# EAGLE design untitled (EAGLE 5.11)
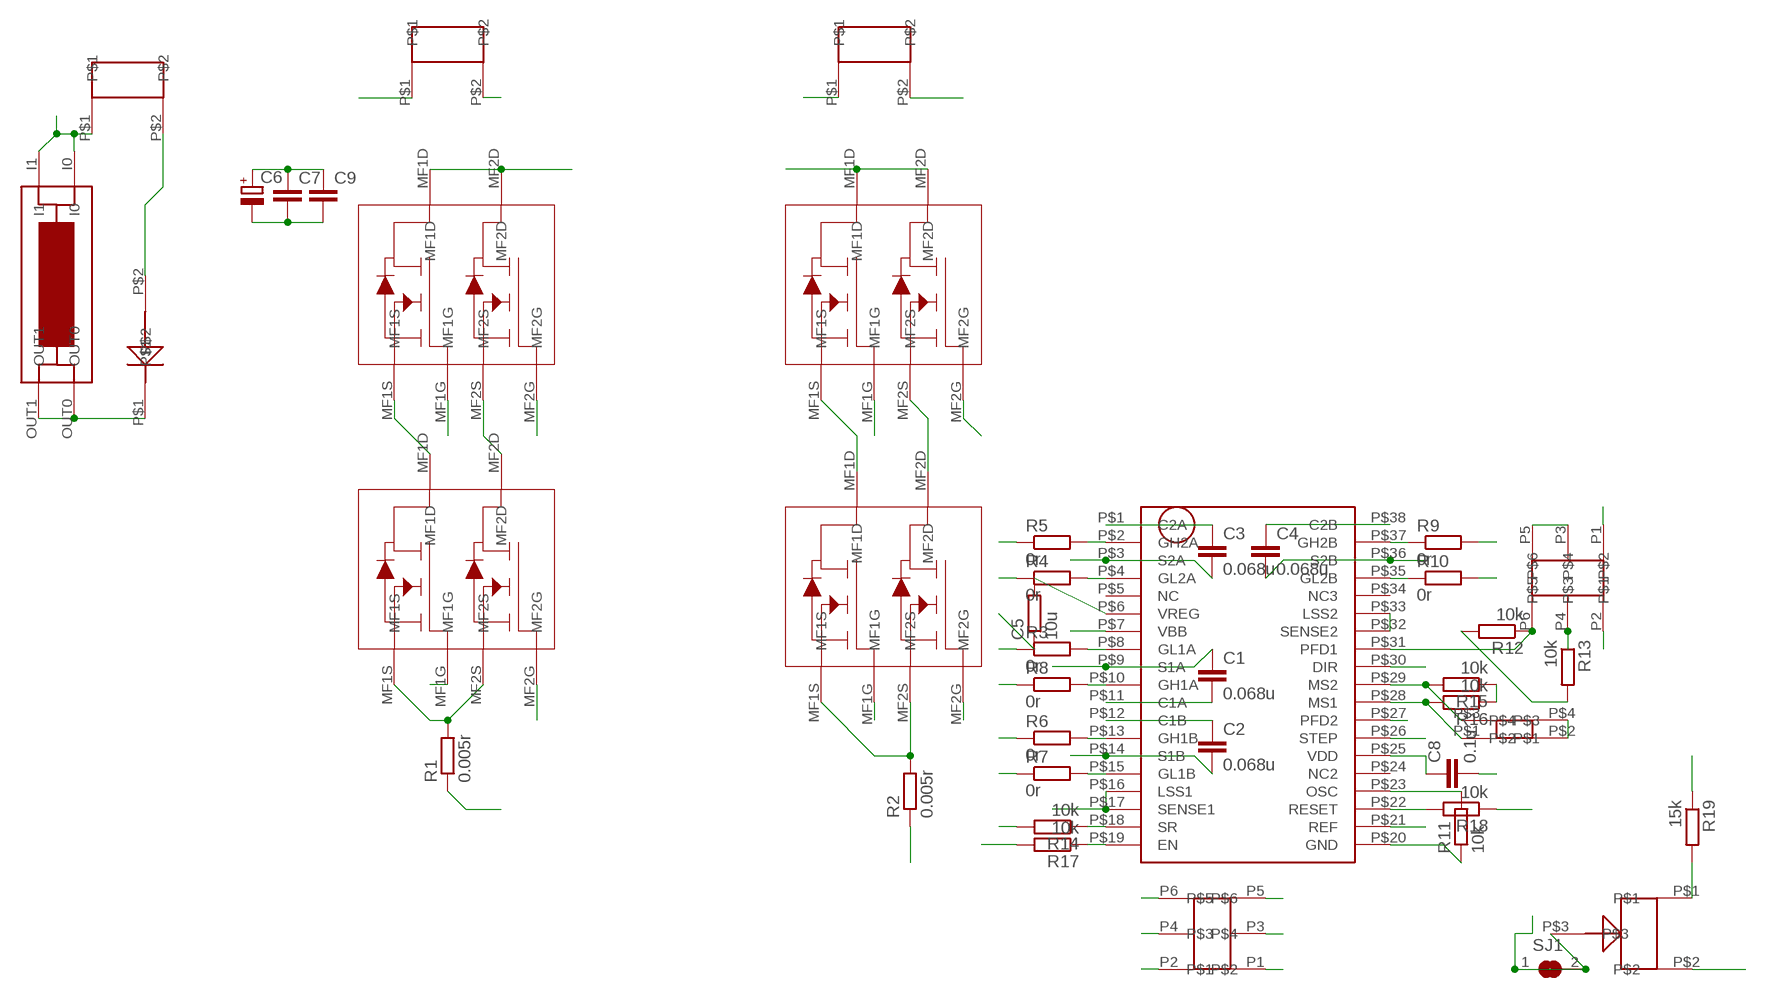
[diagram p0: schematic, sheet 1]

## Parts
C1  0.068u  C-EUC0603K  [C0603K]
C2  0.068u  C-EUC0603K  [C0603K]
C3  0.068u  C-EUC0603K  [C0603K]
C4  0.068u  C-EUC0603K  [C0603K]
C5  10u  R-EU_R0805  [R0805]
C6  CPOL-EU153CLV-1014  [153CLV-1014]
C7  C-EUC0603K  [C0603K]
C8  0.1u  C-EUC0603K  [C0603K]
C9  C-EUC0603K  [C0603K]
R1  0.005r  R-EU_R2512  [R2512]
R2  0.005r  R-EU_R2512  [R2512]
R3  0r  R-EU_R0603  [R0603]
R4  0r  R-EU_R0603  [R0603]
R5  0r  R-EU_R0603  [R0603]
R6  0r  R-EU_R0603  [R0603]
R7  0r  R-EU_R0603  [R0603]
R8  0r  R-EU_R0603  [R0603]
R9  0r  R-EU_R0603  [R0603]
R10  0r  R-EU_R0603  [R0603]
R11  10k  R-EU_R0603  [R0603]
R12  10k  R-EU_R0603  [R0603]
R13  10k  R-EU_R0603  [R0603]
R14  10k  R-EU_R0603  [R0603]
R15  10k  R-EU_R0603  [R0603]
R16  10k  R-EU_R0603  [R0603]
R17  10k  R-EU_R0603  [R0603]
R18  10k  R-EU_R0603  [R0603]
R19  15k  R-EU_R0603  [R0603]
SJ1  SJ  [SJ]
U$1  IPG20N04S4L-11  [SUPERSO8]
U$2  IPG20N04S4L-11  [SUPERSO8]
U$3  IPG20N04S4L-11  [SUPERSO8]
U$4  IPG20N04S4L-11  [SUPERSO8]
U$5  950-D-SMD-DS-2  [950-D-SMD-2]
U$6  950-D-SMD-DS-2  [950-D-SMD-2]
U$7  950-D-SMD-DS-2  [950-D-SMD-2]
U$8  A4989  [TSSOP38]
U$9  SMD.1X6  [SMD0.1X6]
U$10  SMD.1  [SMD0.1]
U$11  SMD.1X6  [SMD0.1X6]
U$12  MINIFUSE  [MINIFUSE]
U$13  FM4004  [SMX]
U$19  10K  TRIMMER3MM  [TRIMMER3MM]

## Nets
COIL1+: C1.1 U$1.MF1S U$2.MF1D U$5.P$2 U$8.P$9(S1A)
COIL1-: C2.2 U$1.MF2S U$2.MF2D U$5.P$1 U$8.P$14(S1B)
COIL2+: C3.2 U$3.MF1S U$4.MF1D U$6.P$2 U$8.P$3(S2A)
COIL2-: C4.2 U$3.MF2S U$4.MF2D U$6.P$1 U$8.P$36(S2B)
DIR: U$8.P$30(DIR) U$11.P6
EN: R17.1 U$8.P$19(EN) U$11.P3
GH1A: R8.1 U$1.MF1G
GH1B: R6.1 U$1.MF2G
GH2A: R5.1 U$3.MF1G
GH2B: R9.2 U$3.MF2G
GL1A: R3.1 U$2.MF1G
GL1B: R7.1 U$2.MF2G
GL2A: R4.1 U$4.MF1G
GL2B: R10.2 U$4.MF2G
GND: C5.1 C6.- C7.2 C8.2 C9.2 R1.1 R2.1 R11.1 R14.2 R17.2 U$7.P$2 U$8.P$20(GND) U$9.P3 U$9.P5 U$10.P$2 U$10.P$4 U$11.P2 U$13.P$2 U$19.P$2
N$1: R5.2 U$8.P$2(GH2A)
N$2: R4.2 U$8.P$4(GL2A)
N$3: C4.1 U$8.P$38(C2B)
N$4: C3.1 U$8.P$1(C2A)
N$5: R3.2 U$8.P$8(GL1A)
N$6: R8.2 U$8.P$10(GH1A)
N$7: R6.2 U$8.P$13(GH1B)
N$8: R7.2 U$8.P$15(GL1B)
N$9: R10.1 U$8.P$35(GL2B)
N$10: R9.1 U$8.P$37(GH2B)
N$11: C5.2 U$8.P$6(VREG)
N$12: R11.2 U$8.P$23(OSC)
N$13: C2.1 U$8.P$12(C1B)
N$14: C1.2 U$8.P$11(C1A)
N$15: U$7.P$1 U$12.I0 U$12.I1
N$16: R19.2 U$19.P$1
N$17: R15.2 U$8.P$29(MS2) U$10.P$3
N$18: R16.2 U$8.P$28(MS1) U$10.P$1
PDF1: R12.1 U$8.P$31(PFD1) U$9.P6
PDF2: R13.1 U$8.P$27(PFD2) U$9.P4
REF: SJ1.1 SJ1.2 U$8.P$21(REF) U$19.P$3
RESET: R18.2 U$8.P$22(RESET) U$11.P5
SENSE1: R1.2 U$2.MF1S U$2.MF2S U$8.P$16(LSS1) U$8.P$17(SENSE1)
SENSE2: R2.2 U$4.MF1S U$4.MF2S U$8.P$32(SENSE2) U$8.P$33(LSS2)
SR: R14.1 U$8.P$18(SR) U$9.P2
STEP: U$8.P$26(STEP) U$11.P4
VBB: C6.+ C7.1 C9.1 U$1.MF1D U$1.MF2D U$3.MF1D U$3.MF2D U$8.P$7(VBB) U$12.OUT0 U$12.OUT1 U$13.P$1
VDD: C8.1 R12.2 R13.2 R15.1 R16.1 R18.1 R19.1 U$8.P$25(VDD) U$9.P1 U$11.P1
Unconnected: U$8.P$5(NC) U$8.P$24(NC2) U$8.P$34(NC3)

## Library data of the parts
C1-C4 C7-C9 = rcl:C-EU: CAPACITOR, European symbol
C5 R3-R19 = rcl:R-EU_: RESISTOR, European symbol
C6 = resistor:CPOL-EU: POLARIZED CAPACITOR, European symbol
R1 R2 = resistor:R-EU_: RESISTOR, European symbol
SJ1 = jumper:SJ: SMD solder JUMPER
U$1-U$4 = untitled:IPG20N04S4L-11
U$5-U$7 = untitled:950-D-SMD-DS-2
U$8 = untitled:A4989
U$9 U$11 = untitled:SMD.1X6
U$10 = untitled:SMD.1
U$12 = untitled:MINIFUSE
U$13 = untitled:FM4004
U$19 = untitled:TRIMMER3MM

## Board
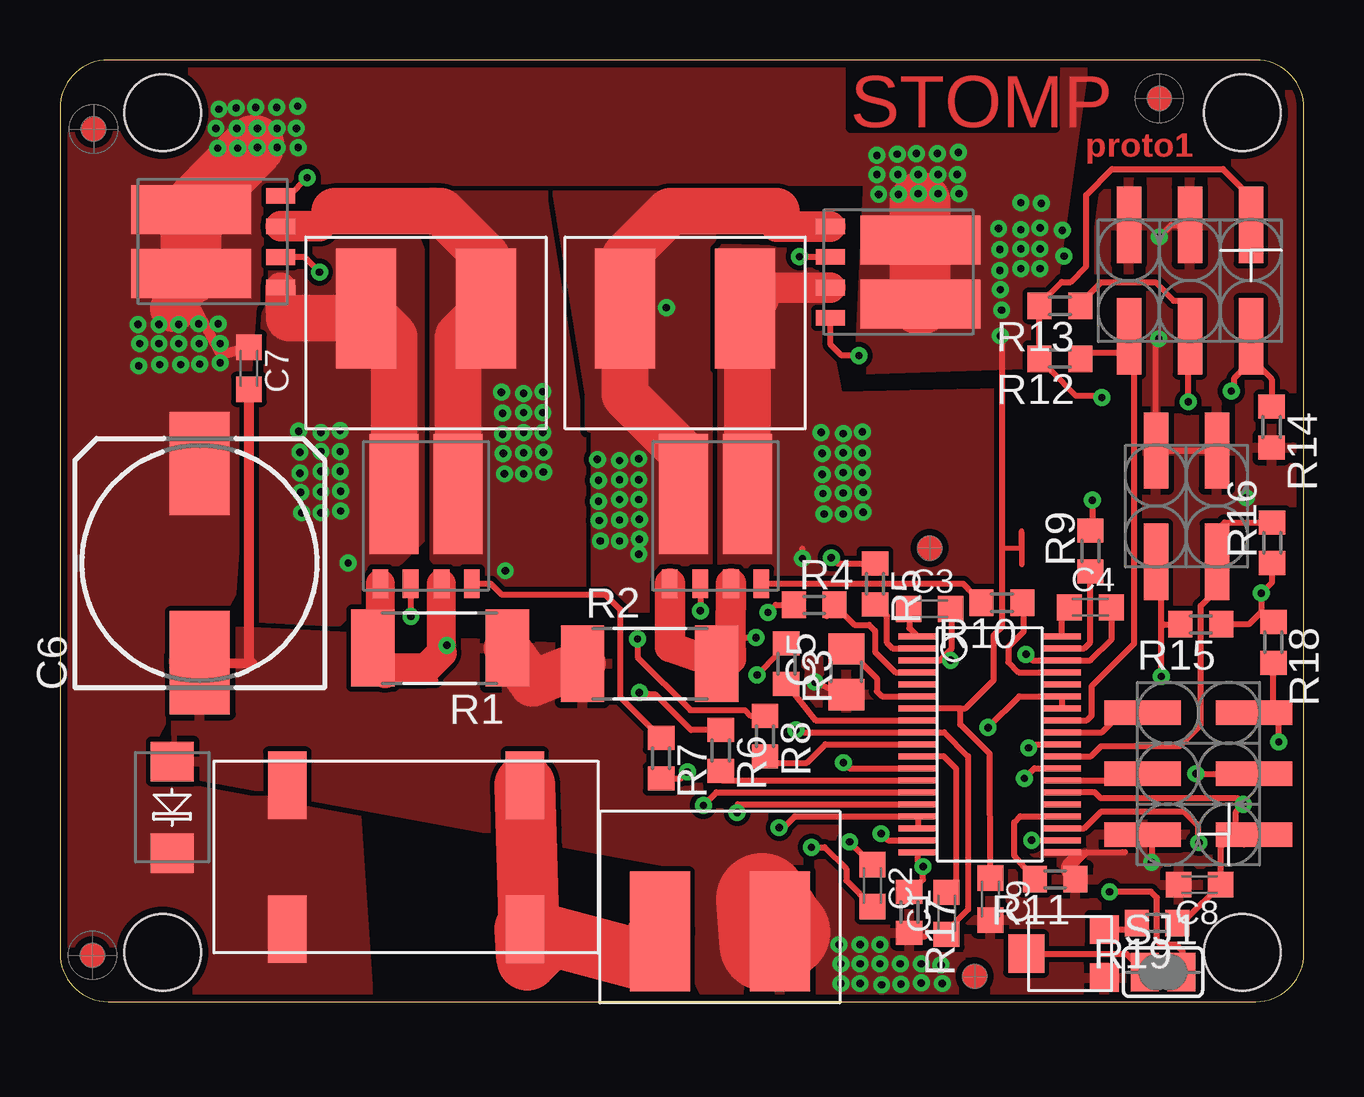
[diagram p1: board, top side]
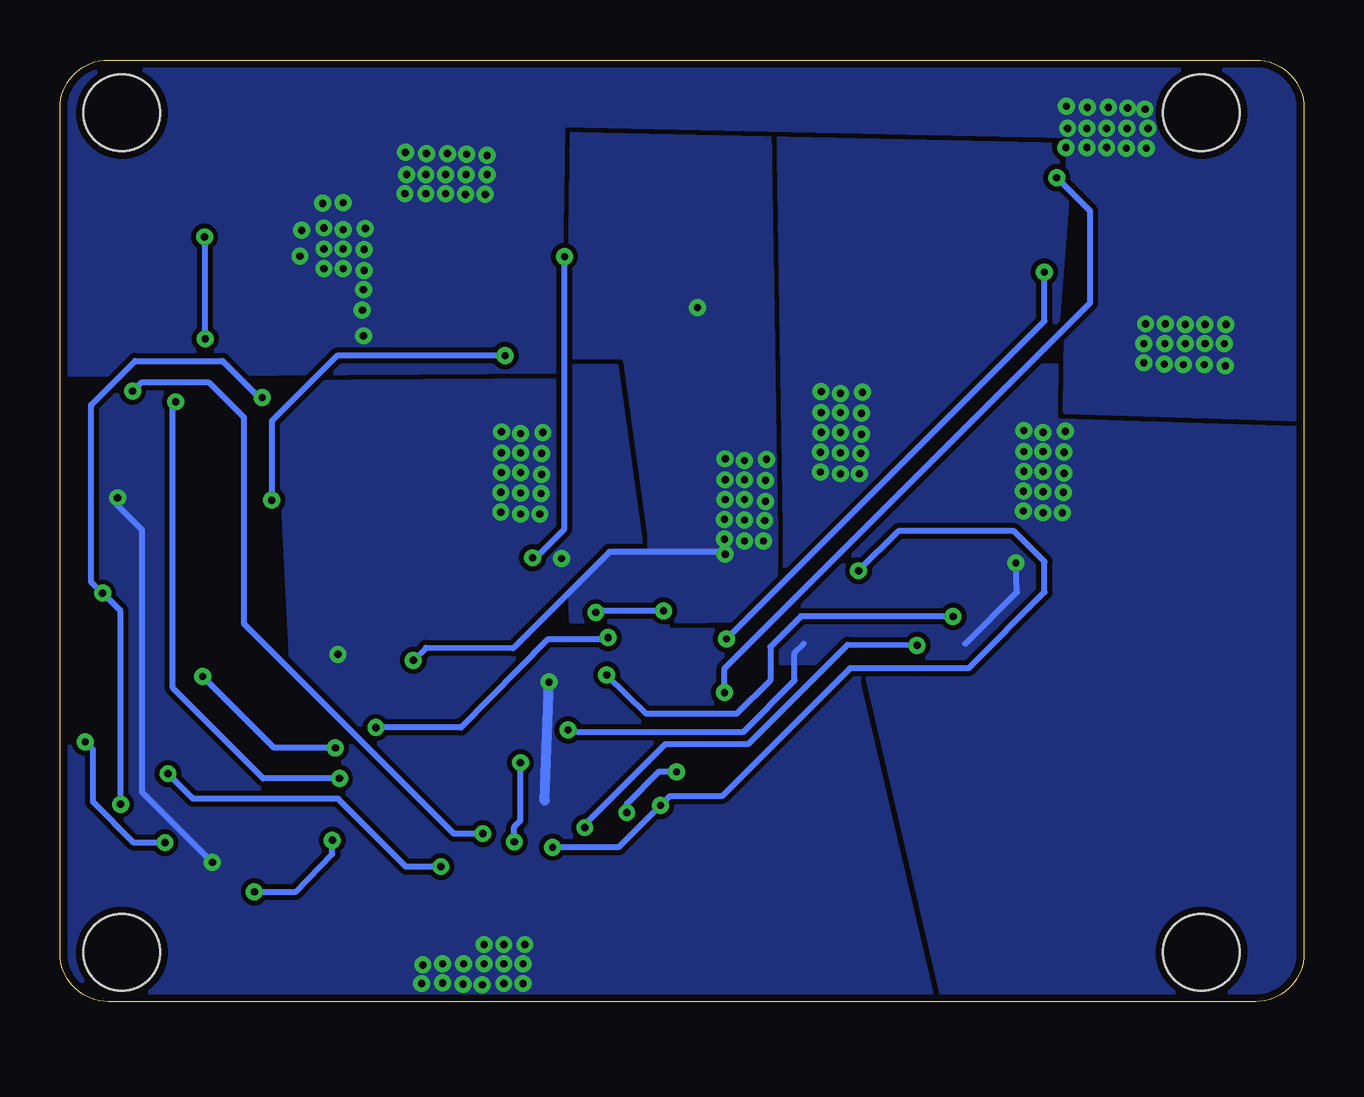
[diagram p2: board, bottom side, seen from below]

Size 51.85 x 39.25 mm. Coordinates in mm from the lower left corner, seen from the top.
Outline: 51.85,37.25 arc90 49.85,39.25 2,39.25 arc90 0,37.25 0,2 arc90 2,0 49.85,0 arc90 51.85,2 51.85,37.25
Copper layers (1*16): Top 0.035mm / dielectric 1.5mm / Bottom 0.035mm
Design rules "default *": minimum track width 8mil, minimum drill 0.3mm, track to track 8mil, track to pad 8mil, pad to pad 8mil, via to via 8mil, smd to smd 4mil, copper to edge 12mil, drill to drill 10mil, minimum pad ring 10mil, minimum via ring 8mil, stop-mask expansion 4mil, vias tented up to drill 20mil, thermal gap 10mil
Holes 3.2 mm at 4.28,2.05 49.27,2.05 4.28,37.05 49.27,37.05

### Footprints (pad centres in the part's own frame; a part is rotated, then mirrored left to right if it is on the bottom)
C0603K = smd 1.05 x 1.08: 1 -0.875,0; 2 0.875,0
R0805 = smd 1.3 x 1.5: 1 -0.95,0; 2 0.95,0
153CLV-1014 = smd 4.3 x 2.5: + 4.15,0; - -4.15,0
R2512 = smd 1.8 x 3.2: 1 -2.8,0; 2 2.8,0
R0603 = smd 1 x 1.1: 1 -0.85,0; 2 0.85,0
SJ = smd 1.168 x 1.6: 1 -0.762,0; 2 0.762,0
SUPERSO8 = smd 2.035 x 5: MF1D -1.335,0.91; MF2D 1.335,0.91 | smd 0.65 x 1.2: MF1G -0.645,-2.825; MF1S -1.905,-2.825; MF2G 1.905,-2.825; MF2S 0.645,-2.825
950-D-SMD-2 = smd 2.5 x 5: P$1 -2.5,-1.02; P$2 2.5,-1.02
TSSOP38 = smd 0.254 x 1.6: P$1 -4.5,-3; P$2 -4,-3; P$3 -3.5,-3; P$4 -3,-3; P$5 -2.5,-3; P$6 -2,-3; P$7 -1.5,-3; P$8 -1,-3; P$9 -0.5,-3; P$10 0,-3; P$11 0.5,-3; P$12 1,-3; P$13 1.5,-3; P$14 2,-3; P$15 2.5,-3; P$16 3,-3; P$17 3.5,-3; P$18 4,-3; P$19 4.5,-3; P$20 4.5,3; P$21 4,3; P$22 3.5,3; P$23 3,3; P$24 2.5,3; P$25 2,3; P$26 1.5,3; P$27 1,3; P$28 0.5,3; P$29 0,3; P$30 -0.5,3; P$31 -1,3; P$32 -1.5,3; P$33 -2,3; P$34 -2.5,3; P$35 -3,3; P$36 -3.5,3; P$37 -4,3; P$38 -4.5,3
SMD0.1X6 = smd 1.02 x 3.18: P1 -2.54,-2.32; P2 -2.54,2.32; P3 0,-2.32; P4 0,2.32; P5 2.54,-2.32; P6 2.54,2.32
SMD0.1 = smd 1.02 x 3.18: P$1 -1.27,2.32; P$2 -1.27,-2.32; P$3 1.27,2.32; P$4 1.27,-2.32
MINIFUSE = smd 1.6 x 2.8: I0 -4.95,-3; I1 -4.95,3; OUT0 4.95,-3; OUT1 4.95,3
SMX = smd 1.651 x 1.778: P$1 -1.905,0; P$2 1.905,0
TRIMMER3MM = smd 1.2 x 1.2: P$1 1,-1.6; P$2 -1,-1.6 | smd 1.6 x 1.5: P$3 0,1.65

### Placement (x,y rotation side)
C1  36.95,3.68 90 top
C2  33.87,4.83 270 top
C3  36.25,16.37 0 top
C4  42.95,16.43 0 top
C5  32.77,13.74 90 top
C6  5.83,18.27 90 top
C7  7.88,26.4 270 top
C8  47.5,4.88 180 top
C9  38.77,4.28 270 top
R1  15.85,14.73 180 top
R2  24.57,14.09 0 top
R3  30.27,14.09 270 top
R4  31.43,16.54 0 top
R5  33.98,17.41 270 top
R6  27.54,10.47 270 top
R7  25.05,10.14 270 top
R8  29.39,11.06 270 top
R9  42.95,18.78 90 top
R10  39.26,16.63 180 top
R11  41.48,5.1 180 top
R12  41.67,26.8 180 top
R13  41.67,29 180 top
R14  50.5,23.95 270 top
R15  47.55,15.72 180 top
R16  50.52,19.12 90 top
R17  35.4,3.73 270 top
R18  50.58,14.97 270 top
R19  45.73,3.27 180 top
SJ1  45.98,1.23 0 top
U$1  6.37,31.68 90 top
U$2  15.26,20.25 0 top
U$3  34.95,30.41 270 top
U$4  27.32,20.25 0 top
U$5  15.26,27.86 180 top
U$6  26.05,27.86 180 top
U$7  27.5,3.94 0 top
U$8  38.76,10.72 270 top
U$9  47.1,30.05 180 top
U$10  46.95,20.65 180 top
U$11  47.45,9.5 90 top
U$12  14.43,6.03 180 top
U$13  4.67,8.1 90 top
U$14  [FIDUCIAL_G10]  1.35,1.93 0 top
U$15  [FIDUCIAL_G10]  1.4,36.38 0 top
U$16  [FIDUCIAL_G10]  45.83,37.65 0 top
U$17  [FIDUCIAL_L10]  36.25,18.9 0 top
U$18  [FIDUCIAL_L10]  38.12,1.05 0 top
U$19  41.92,2 90 top

### Tracks (layer width: path | path; a pad name or v marks a point on that pad's centre or on a via)
COIL1+  (via drill 0.3)
  Top 0.254: 13.93,20.05 U$2.MF1D | v30.68,11.32 31,11.22 U$8.P$9 36.86,11.22 37.85,10.23 37.85,3.83 36.95,2.9 C1.1
  Top 1.27: U$1.MF1S 9.2,28.85 9.54,28.5
  Top 1.93: 12.38,28.5 9.54,28.5 | 12.38,28.5 U$5.P$2 13.93,27.72 U$2.MF1D | 12.38,28.5 12.72,28.16
  Bottom 0.254: v12.01,18.29 11.96,17.07 14.12,14.91 | 20.85,14.91 21.23,14.53 21.23,13.39 23.39,11.23 30.25,11.23 v30.68,11.32
  other vias: 11.7,20.45 11.7,21.27 11.68,22.1 11.68,22.93 11.68,23.8 10.88,23.73 10.88,22.93 10.88,22.1 10.88,21.25 10.88,20.38 10.07,20.38 10.03,21.23 10,22.02 10,22.9 9.95,23.77
  pour Top (rank 6, no thermals): 15.05,31.25 13.28,35.83 5.4,29.93 6.83,16.35 9.05,13.6 10,14.25 15.3,19.55
  pour Bottom (rank 2): 8.12,26.48 10.9,26.48 23.23,14.15 18.32,14.15 15.03,0.12 -2.27,-0.2 -4.83,11.1 -3.15,22.93 -3.58,24.8
COIL1-  (via drill 0.3)
  Top 0.254: 16.59,19.93 U$2.MF2D | v26.82,8.18 27.36,8.72 U$8.P$14 | v31.32,6.43 31.87,6.43 32.77,5.53 32.77,5.05 C2.2
  Top 1.27: U$1.MF2S 10.82,32.32 11.45,32.95
  Top 1.93: U$5.P$1 17.76,29.2 | 11.45,32.95 15.89,32.95 17.8,31.04 17.8,28.93 U$5.P$1 | U$2.MF2D 16.59,27.72 U$5.P$1
  Bottom 0.254: v18.56,17.96 16.91,19.61 12.09,19.61 10.81,18.34 10.81,17.07 13.99,13.89 18.93,13.89 24.26,8.56 26.44,8.56 v26.82,8.18 28.56,6.43 v31.32,6.43
  other vias: 20.15,22.07 20.15,22.9 20.12,23.73 20.12,24.55 20.12,25.43 19.32,25.35 19.32,24.55 19.32,23.73 19.32,22.88 19.32,22 18.52,22 18.48,22.85 18.45,23.65 18.45,24.52 18.4,25.4
  pour Bottom (rank 5): 9.7,36.05 10.3,28.4 22.18,16.52 22.18,32.38 22.2,36.98
  pour Top (rank 5, no thermals): 15.6,34.05 15.6,18.48 18.52,15.55 20.65,15.55 22.02,16.93 22.02,34.62 20.85,35.8
COIL2+  (via drill 0.3)
  Top 0.254: C3.2 37.17,16.36 37.17,14.72 36.67,14.22 U$8.P$3 37.35,14.22 v37.12,14.22 | v24.12,18.65 24.12,19.29
  Top 1.27: 29.86,32.95 29.86,32.31 U$3.MF1S
  Top 1.93: 29.86,32.95 25.42,32.95 23.55,31.08 U$6.P$2 23.55,25.29 26.05,22.79 26.05,21.22 U$4.MF1D
  Bottom 0.254: v24.12,18.65 24.23,18.75 28.95,18.75 32.98,14.72 36.6,14.75 v37.12,14.22
  other vias: 24.15,19.27 24.15,20.1 24.12,20.93 24.12,21.75 24.12,22.62 23.32,22.55 23.32,21.75 23.32,20.93 23.32,20.07 23.32,19.2 22.52,19.2 22.48,20.05 22.45,20.85 22.45,21.73 22.4,22.6 25.27,28.93
  pour Bottom (rank 4): 22.3,36.4 31.18,37 30.52,15.88 22.02,15.93 22.02,19.55
  pour Top (rank 3, no thermals): 20.73,33.85 27.12,33.85 27.12,16.4 22.35,16.4 22.35,23.8 22.1,23.93 22.1,25.27
COIL2-  (via drill 0.3)
  Top 0.254: C4.2 43.84,16.42 43.84,15.1 42.95,14.22 U$8.P$36 40.53,14.22 v40.27,14.48 | v30.95,18.47 30.95,18.87
  Top 1.27: U$3.MF2S 29.43,29.76 29.02,29.35 U$6.P$1
  Top 1.93: U$4.MF2D 28.66,28.99 29.02,29.35
  other vias: 33.48,20.4 33.48,21.23 33.45,22.05 33.45,22.88 33.45,23.75 32.65,23.68 32.65,22.88 32.65,22.05 32.65,21.2 32.65,20.32 31.85,20.32 31.8,21.18 31.77,21.98 31.77,22.85 31.73,23.73
  pour Top (rank 2, no thermals): 27.65,31.48 27.5,31.3 27.5,17.55 42.08,17.55 41.27,25.5 32.5,25.3 31.35,31.38
  pour Bottom (rank 3): 28.68,26.45 42.83,26.45 41.95,9.3 27.55,15.03 27.55,18.3
DIR
  Top 0.254: U$8.P$30 43.44,11.22 44.27,12.05 44.8,12.05 U$11.P6
EN  (via drill 0.3)
  Top 0.254: U$8.P$19 35.76,5.84 v35.98,5.62 35.98,5.08 R17.1 | v47.35,9.5 U$11.P3
  Bottom 0.254: v35.98,5.62 37.42,5.62 40.25,8.45 46.3,8.45 v47.35,9.5
GH1A  (via drill 0.3)
  Top 0.254: U$1.MF1G 10.19,31.03 v10.81,30.41 | v24.07,15.12 24.07,14.35 26.28,12.15 28.55,12.15 28.79,11.91 R8.1
  Bottom 0.254: v10.81,30.41 10.81,28.37 v24.07,15.12
GH1B  (via drill 0.3)
  Top 0.254: U$1.MF2G 9.54,33.58 v10.31,34.34 | R6.1 26.31,11.32 24.82,12.8 24.23,12.8 v24.15,12.88
  Bottom 0.254: v10.31,34.34 8.91,32.95 8.91,29.14 24.15,13.89 v24.15,12.88
GH2A  (via drill 0.3)
  Top 0.254: v30.82,31.05 U$3.MF1G | v32.15,18.5 32.39,18.26 R5.1
  Bottom 0.254: v32.15,18.5 32.02,18.5 30.82,19.7 v30.82,31.05
GH2B  (via drill 0.3)
  Top 0.254: v43.02,20.9 43.02,19.71 R9.2 | U$3.MF2G 32.12,27.38 32.55,26.95 33.27,26.95 v33.3,26.93
  Bottom 0.254: v33.3,26.93 40.3,26.93 43.02,24.2 v43.02,20.9
GL1A  (via drill 0.3)
  Top 0.254: U$2.MF1G 14.62,16.06 v14.62,16.05 | v29.06,13.62 29.96,14.54 R3.1
  Bottom 0.254: v14.62,16.05 20.98,16.05 22.25,14.78 22.25,13.39 23.64,11.99 27.41,11.99 v29.06,13.62
GL1B
  Top 0.254: U$2.MF2G 17.95,17.42 18.4,16.98 22.73,16.98 23.35,16.35 23.35,12.7 R7.1
GL2A  (via drill 0.3)
  Top 0.254: U$4.MF1G 26.7,16.3 v26.69,16.29 | R4.1 29.84,16.54 v29.52,16.21
  Bottom 0.254: v26.69,16.29 29.44,16.29 v29.52,16.21
GL2B
  Top 0.254: U$4.MF2G 37.64,17.42 37.86,17.2 38.31,16.73 R10.2
GND  (via drill 0.3)
  Top 0.254: C5.1 32.42,12.87 v31.47,13.32 | 42.48,6.22 U$8.P$20 | 42.4,6.14 42.48,6.22 | v45.8,27.62 45.68,27.5 U$10.P$4 U$10.P$2 48.22,22.23 | U$9.P3 46.32,32.37 v45.83,31.88 | v45.5,5.8 45.5,6.59 U$11.P2 | R17.2 36.05,2.7 | 42.48,6.22 44.3,6.22 | 44.39,6.22 42.8,6.22 41.95,5.38 42.05,5.38 R11.1
  Top 0.406: 41.95,5.38 41.95,5.7 42.4,6.14 | C6.- 8.03,14.1 7.88,14.25 C7.2
  Top 1.93: R1.1 19.7,13.26 R2.1
  Top 3.81: 29.85,3.3 29.93,3.2 29.25,4.28 29.4,2.35 30.2,2.9
  Bottom 0.254: v45.8,27.62 45.8,31.85 v45.83,31.88 | v49.45,21 49.45,20.68 48.42,19.65 48.42,8.72 v45.5,5.8
  Bottom 0.406: 31.64,8.37 v31.47,13.32
  other vias: 36.77,0.75 36.73,1.52 34.17,2.38 33.35,2.38 32.48,2.38 32.55,1.57 33.35,1.57 34.17,1.57 35.02,1.57 35.9,1.57 35.9,0.78 35.05,0.72 34.25,0.7 33.35,0.75 32.55,0.75
  pour Top: 40.75,13.75 4.67,15.57 4.88,9.6 25.23,5.85 25.88,5.2 25.88,2.38 27.23,-0.4 53.05,0.1 54.08,1.12 52.35,39.92 43.73,35.27
  pour Bottom (rank 6): 42.62,25.55 50.4,25.55 53.52,22.43 53.52,0.65 52.2,-0.68 15.57,-0.68 15.35,-0.45 15.35,12.35 18.75,15.75
N$1
  Top 0.254: U$8.P$2 34.7,14.72 34.48,14.95 34.48,16.06 R5.2
N$2
  Top 0.254: 31.96,16.06 R4.2 33.12,15.7 33.73,15.7 33.98,15.45 33.98,14.57 34.83,13.72 U$8.P$4
N$3
  Top 0.254: U$8.P$38 41.76,16.12 C4.1
N$4
  Top 0.254: C3.1 35.4,15.57 U$8.P$1
N$5
  Top 0.254: U$8.P$8 31.49,11.72 R3.2
N$6
  Top 0.254: U$8.P$10 31.9,10.72 31.14,9.96 29.39,9.96 R8.2
N$7
  Top 0.254: U$8.P$13 27.59,9.22 R6.2
N$8  (via drill 0.3)
  Top 0.254: R7.2 25.87,9.29 v26.15,9.57 | U$8.P$15 28.25,8.22 28.25,7.9 v28.23,7.88
  Bottom 0.254: v26.15,9.57 26.9,9.57 28.23,8.25 v28.23,7.88
N$9
  Top 0.254: U$8.P$35 39.95,13.72 39.52,14.15 39.52,14.78 40.17,15.43 40.17,16.56 R10.1
N$10
  Top 0.254: U$8.P$37 42.69,14.72 42.95,14.97 R9.1
N$11
  Top 0.254: U$8.P$6 34.26,12.72 34.05,12.93 34.05,13.47 32.93,14.59 C5.2
N$12
  Top 0.254: U$8.P$23 40.02,7.72 39.77,7.47 39.77,6.08 R11.2
N$13  (via drill 0.3)
  Top 0.254: U$8.P$12 32.9,9.72 v32.66,9.96 | C2.1 32.79,6.78 v32.91,6.66
  Bottom 0.254: v32.66,9.96 32.66,7.54 32.91,7.29 v32.91,6.66
N$14
  Top 0.254: C1.2 37.36,5.02 37.36,9.7 36.84,10.22 U$8.P$11
N$15
  Top 2.54: U$7.P$1 24.3,1.73 U$12.I1 19.48,1.73 19.98,2.23 19.57,2.62 U$12.I0
N$16
  Top 0.254: U$19.P$1 44.6,3 R19.2
N$17  (via drill 0.3)
  Top 0.254: U$8.P$29 40.52,10.72 v40.38,10.57 | v45.9,13.55 45.9,15.62 | 45.9,15.62 45.9,18.11 U$10.P$3 | R15.2 46,15.72 45.9,15.62
  Bottom 0.254: v40.38,10.57 42.92,10.57 v45.9,13.55
N$18
  Top 0.254: U$8.P$28 42.97,10.22 43.4,10.65 46.67,10.65 47.55,11.53 47.55,16.5 48.17,17.12 48.17,18.29 U$10.P$1 48.17,18.38 48.17,19.6 48.55,19.98 R16.2
PDF1
  Top 0.254: U$8.P$31 42.8,11.72 43,11.93 43,13.15 44.77,14.93 44.77,26.82 44.56,27.04 | 44.56,27.04 U$9.P6 | 44.56,27.04 42.64,27.04 R12.1
PDF2  (via drill 0.3)
  Top 0.254: U$8.P$27 40.62,9.72 v40.2,9.3 | v47.02,25 47.02,27.66 U$9.P4 | U$9.P4 47.02,27.8 | U$9.P4 47.08,27.75 47.08,28.95 46.83,29.2 46.42,29.2 45.67,29.98 43.38,29.98 42.52,29.12 R13.1
  Bottom 0.254: v40.2,9.3 43.38,9.3 47.15,13.07 47.15,24.88 v47.02,25
REF  (via drill 0.3)
  Top 0.203: SJ1.1 SJ1.2
  Top 0.254: U$8.P$21 v40.51,6.72 v40.5,6.72 | U$19.P$3 44.44,2 SJ1.1 | v43.75,4.58 45.48,4.58 45.73,4.33 45.73,2.52 45.88,2.38 46.52,2.38 46.8,2.1 46.8,1.29 SJ1.2
  Bottom 0.254: v40.5,6.72 40.5,6.15 42.02,4.58 v43.75,4.58
RESET  (via drill 0.3)
  Top 0.254: U$8.P$22 42.7,7.22 43.4,7.92 46.85,7.92 47.42,7.35 47.42,6.67 v47.48,6.62 | 50.58,12.24 R18.2 | 50.58,12.24 U$11.P5 | v50.8,10.82 50.8,12.02 50.58,12.24
  Bottom 0.254: 50.58,10.6 v50.8,10.82 50.48,10.5 50.48,8.32 48.77,6.62 v47.48,6.62
SENSE1  (via drill 0.3)
  Top 0.254: 15.13,13.89 15.64,13.39 15.64,14.37 v16.12,14.85 | U$8.P$17 U$8.P$16 30.62,7.72 30.03,7.12 v29.98,7.25
  Top 1.2: 15.9,14.54 U$2.MF2S | 13.36,13.89 U$2.MF1S
  Top 1.27: 15.9,14.54 15.26,13.89 15.13,13.89 13.73,13.89 13.54,13.71 | R1.2 13.54,13.71 | 13.54,13.71 13.36,13.89
  Bottom 0.254: v16.12,14.85 19.02,14.88 23.18,10.72 26.62,10.72 30.02,7.33 v29.98,7.25
SENSE2  (via drill 0.3)
  Top 0.254: U$8.P$32 U$8.P$33 39.98,12.72 v38.68,11.42 | 27.95,15.17 v29,15.17
  Top 1.27: U$4.MF1S 25.42,14.79 R2.2 27.97,14.28 27.95,15.17 U$4.MF2S
  Bottom 0.254: v38.68,11.42 35.14,11.42 31.54,15.09 28.93,15.09 v29,15.17
SR  (via drill 0.3)
  Top 0.254: U$8.P$18 34.51,6.72 v34.23,7 | 49.64,26.8 49.64,26.27 49.22,26.27 48.95,26 48.95,25.57 v48.83,25.45 | 49.64,26.8 U$9.P2 | R14.1 50.5,25.94 49.64,26.8
  Bottom 0.254: v34.23,7 35.42,7 44.17,15.75 44.17,24.35 45.62,25.8 48.48,25.8 v48.83,25.45
STEP
  Top 0.254: U$8.P$26 44.63,9.22 U$11.P4
VBB  (via drill 0.3)
  Top 0.203: 40.08,18.9 40.1,18.93 40.1,19.55 40.08,19.57 | 40.08,18.93 40.08,19.57 | 40.05,18.9 40.1,18.9 40.1,18.23 40.08,18.2 40.08,18.93 | 40.08,19.57 40.08,19.62 | 40.05,18.9 40.08,18.93 | 40.05,18.9 39.3,18.9 39.27,18.88
  Top 0.254: 37.52,12.22 U$8.P$7 | 37.52,12.22 37.74,12.22 38.92,13.4 38.92,15.28 39.27,15.62 39.27,18.88 39.27,27.68 v39.2,27.75 | C9.1 38.75,10.32 37.52,11.55 37.52,12.22
  Top 0.406: C7.1 6.72,26.98 5.58,29.07
  Top 1.93: 4.72,28.88 U$1.MF1D
  Top 2.54: U$3.MF2D U$3.MF1D 35.85,33.3 | 8.09,35.69 5.74,33.28 U$1.MF2D U$1.MF1D
  other vias: 34.12,33.65 34.95,33.65 35.77,33.67 36.6,33.67 37.48,33.67 37.4,34.48 36.6,34.48 35.77,34.48 34.92,34.48 34.05,34.48 34.05,35.27 34.9,35.33 35.7,35.35 36.58,35.35 37.45,35.4 6.58,35.58 7.4,35.58 8.22,35.6 9.05,35.6 9.93,35.6 9.85,36.4 9.05,36.4 8.22,36.4 7.38,36.4 6.5,36.4 6.62,37.2 7.35,37.25 8.15,37.27 9.03,37.27 9.9,37.33 6.6,28.25 5.78,28.25 4.95,28.23 4.12,28.23 3.25,28.23 3.33,27.43 4.12,27.43 4.95,27.43 5.8,27.43 6.67,27.43 6.67,26.62 5.83,26.57 5.03,26.55 4.15,26.55 3.27,26.5 41.85,31.07 41.77,32.15 40.85,30.55 40.85,31.38 40.85,32.25 40.05,32.17 40.05,31.38 40.05,30.55 40.9,33.27 40.05,33.3 39.25,28.82 39.2,29.68 39.17,30.48 39.17,31.35 39.12,32.23
  pour Top (rank 2, no thermals): -0.75,39.38 -0.55,-1.02 6.83,-0.27 12.9,-0.27 12.28,9 3.45,10.2 7.16,17.04 7.83,26.64 8.02,28.97 10.81,34.22 33.67,34.22 33.3,26.35 40.95,26.6 42.73,39.32
  pour Bottom: 0.05,39.55 51.62,39.17 51.55,26.15 31.05,26.3 30.9,36.58 9.8,36.12 9.95,24.62 -0.6,24.27 -0.6,26.57
VDD  (via drill 0.3)
  Top 0.254: U$8.P$25 43.13,8.72 43.38,8.47 49.08,8.47 v49.33,8.22 49.02,7.92 49.02,7.09 48.9,6.97 | 49.55,33.62 49.77,33.8 | U$9.P1 49.77,32.51 49.55,33.62 | 49.55,33.62 48.48,34.7 43.85,34.7 42.77,33.62 42.77,30.65 42.12,30 41.75,30 40.83,29.07 R13.2 R12.2 41.33,26.27 42.35,25.25 43.35,25.25 v43.42,25.18 | R15.1 49.55,15.72 50.08,16.25 | 50.08,16.25 v50.08,17.02 50.52,17.48 R16.1 | R18.1 50.5,15.82 50.08,16.25 | U$11.P1 49.35,6.54 48.92,6.97 48.9,6.97 | R19.1 46.92,3.42 C8.1 48.38,6.45 48.9,6.97
  Bottom 0.254: v49.33,8.22 49.33,16.27 v50.08,17.02 50.55,17.5 50.55,24.88 48.73,26.7 45.08,26.7 43.55,25.18 v43.42,25.18

### Text on the board
Top: STOMP | proto1
tRestrict: S
silk: STOMP | pdf2 | COIL 1 | COIL2 | pdf1 | sr | + | - | + | - | Design by | Kliment | dedicated to | #reprap@freenode | + | ms2 | ms1 | W | . | rst | dir | - | fuse | stp | en | GND | vdd | 48V MAX + | -